# EAGLE board keyBoard_B (EAGLE 6.4)
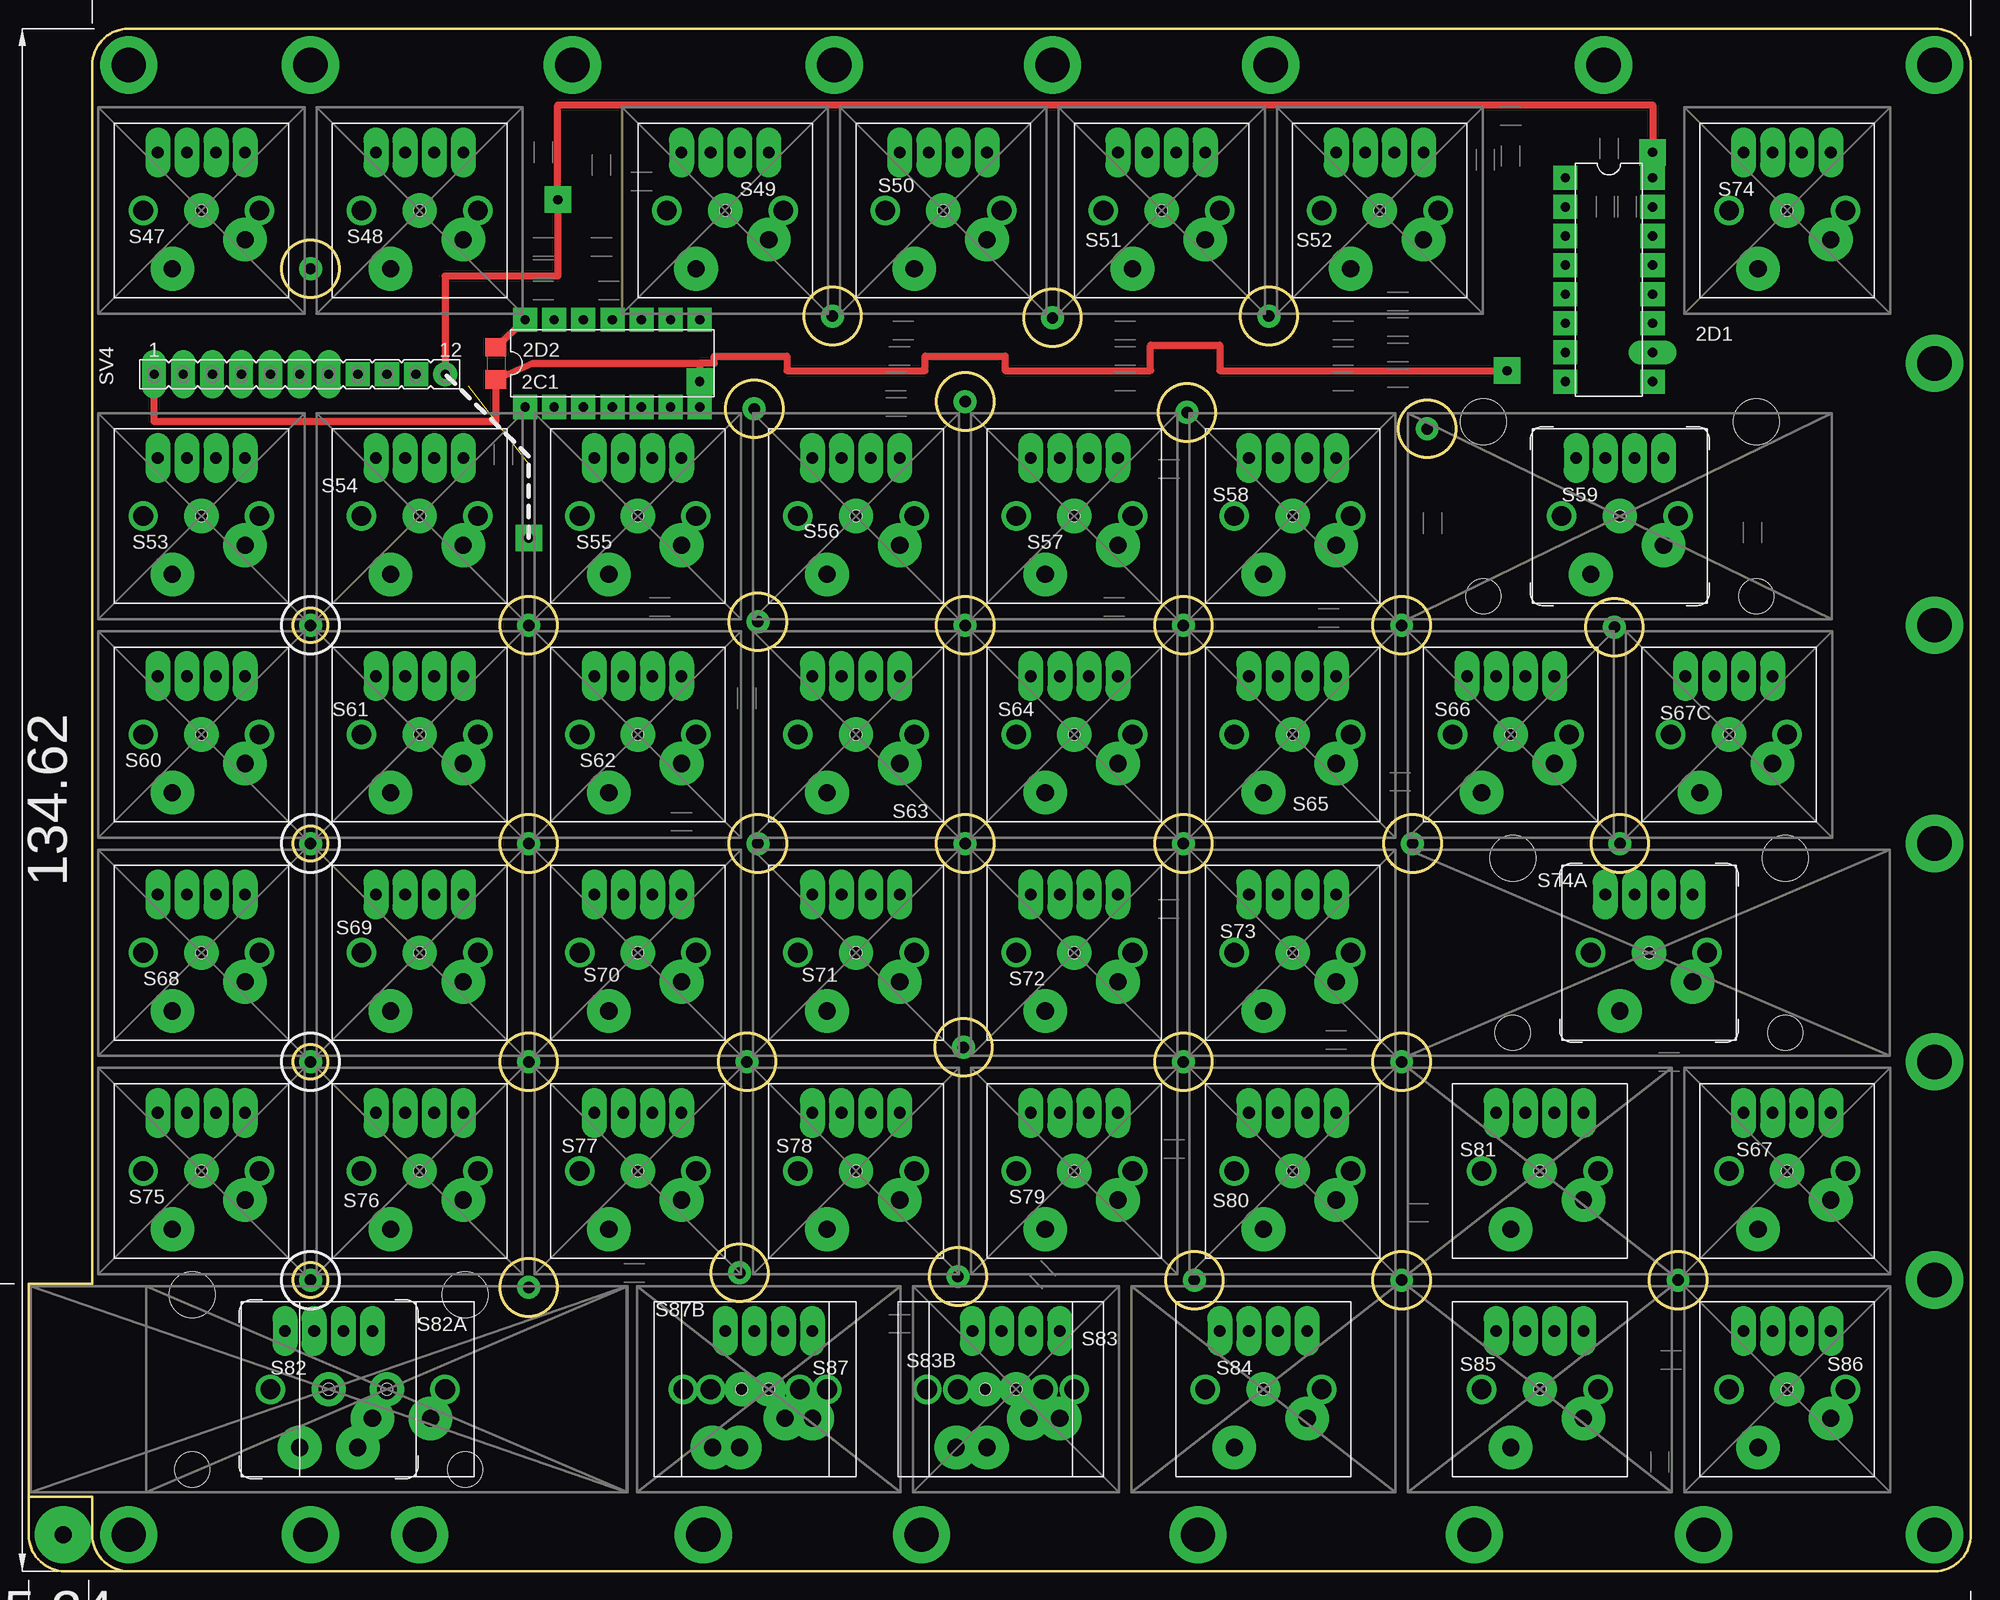
[diagram p1: board, top side]
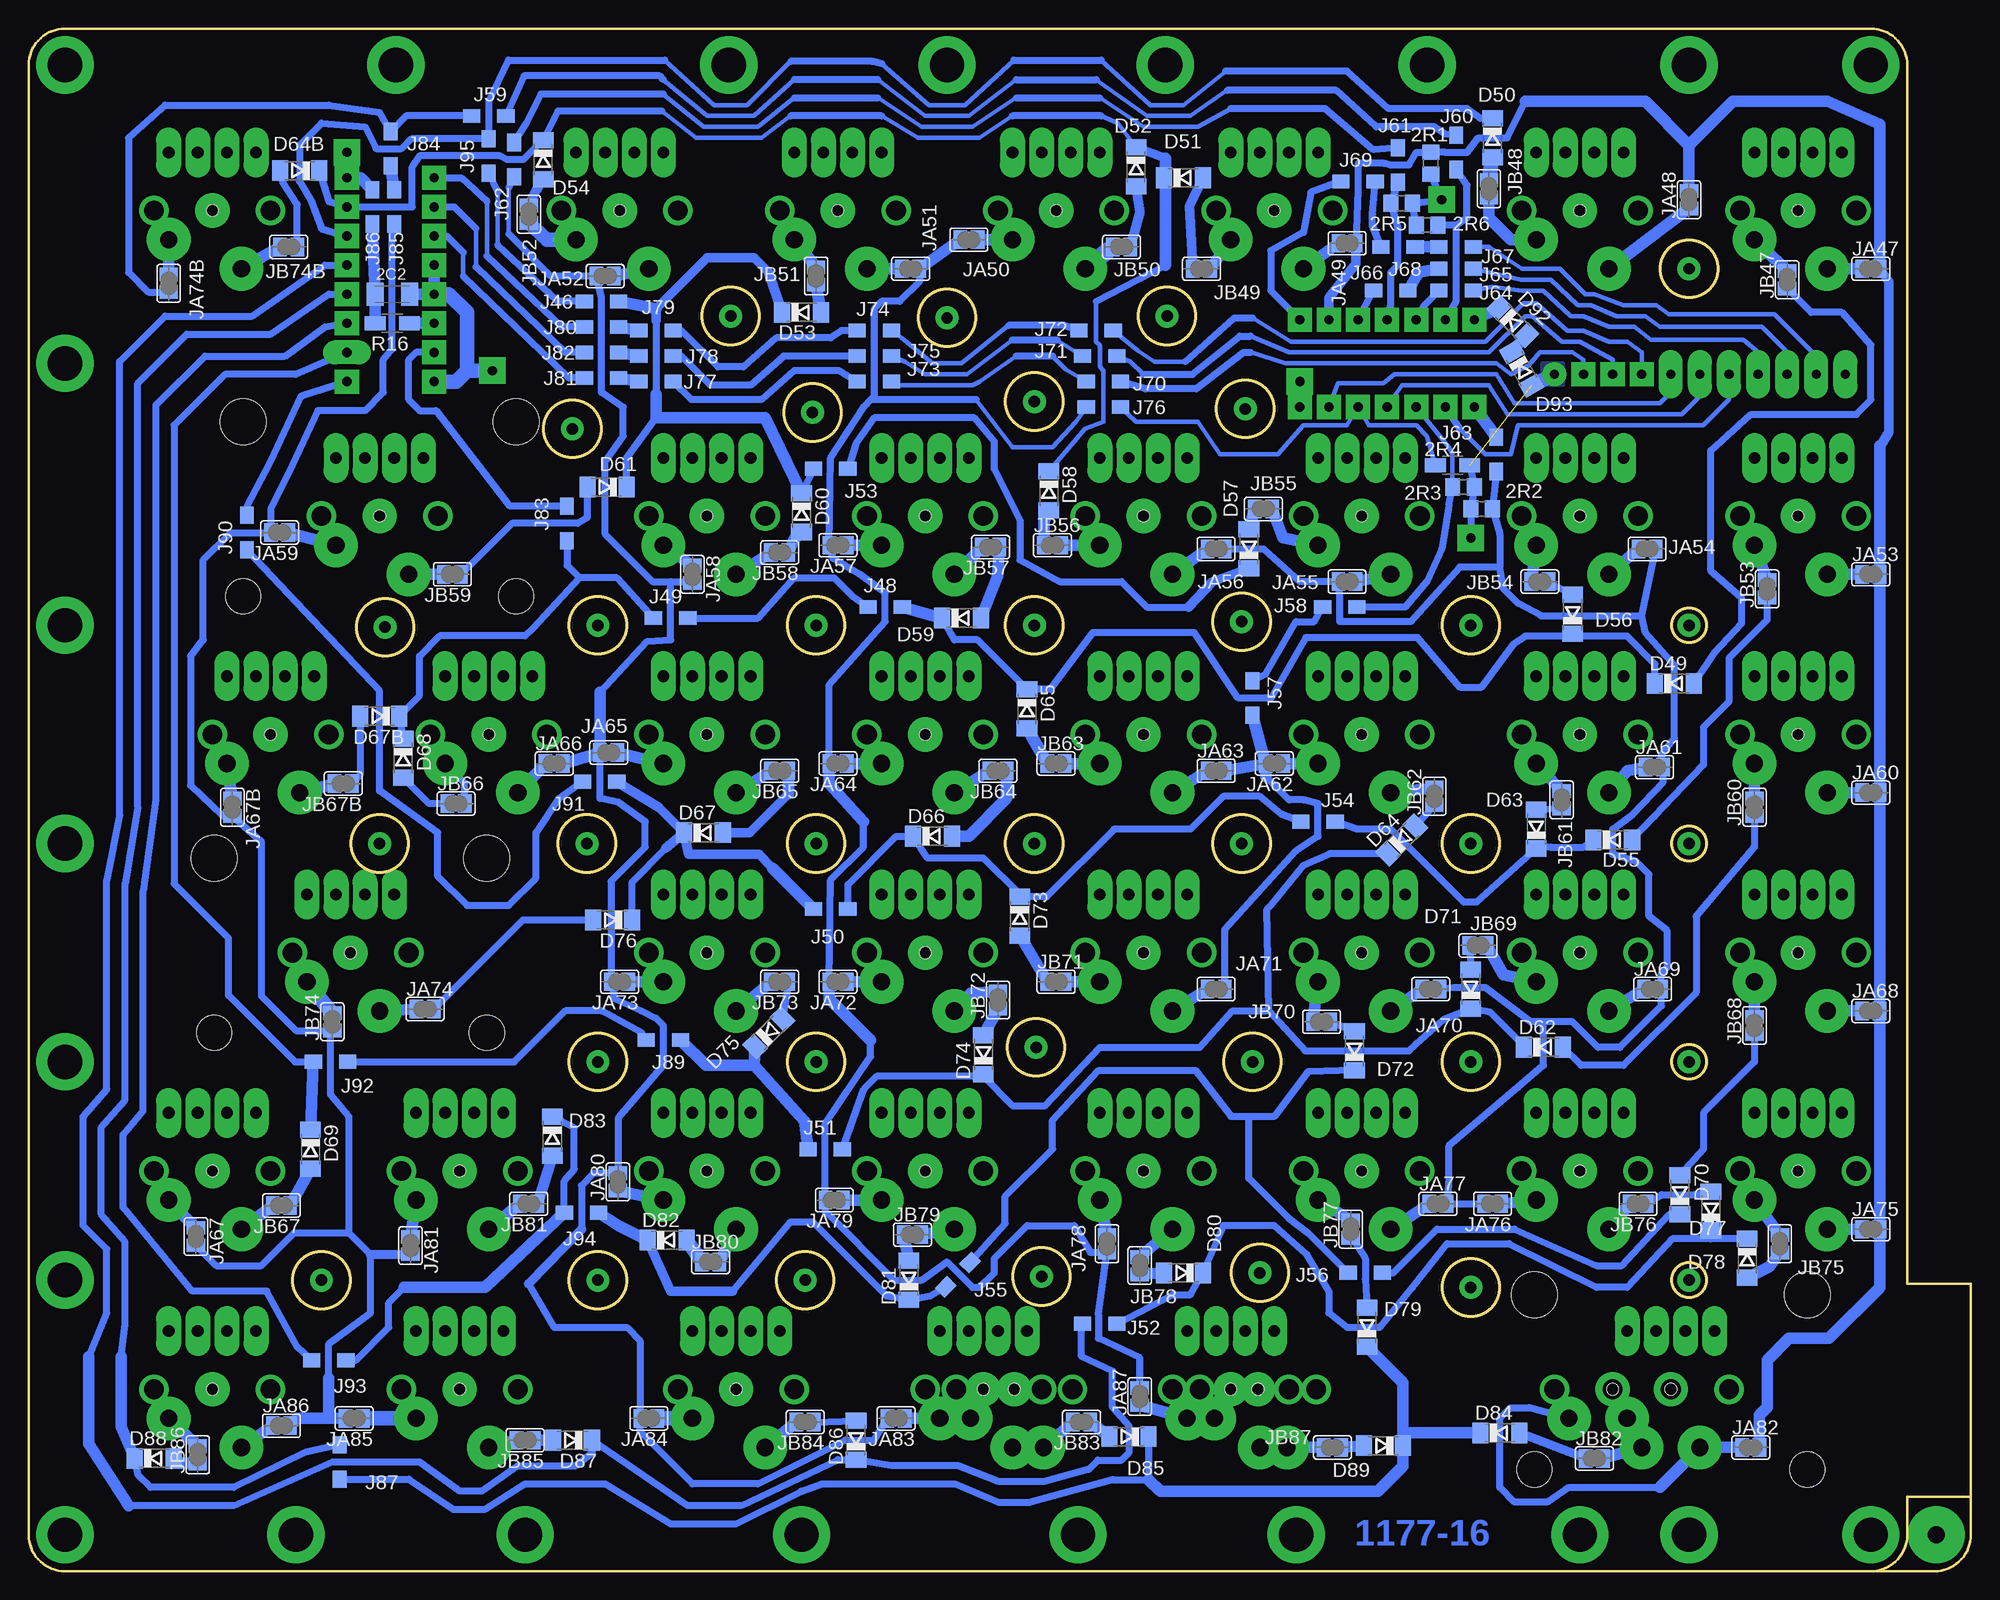
[diagram p2: board, bottom side, seen from below]

Size 169.54 x 134.62 mm. Coordinates in mm from the lower left corner, seen from the top.
Outline: 8.73,0 166.37,0 arc90 169.54,3.18 169.54,131.44 arc90 166.37,134.62 8.73,134.62 arc90 5.56,131.44 5.56,25.08 0,25.08 0,6.51
Outline: 8.73,0 3.02,0
Outline: 0,6.51 5.56,6.51 5.56,3.18 arc90 8.73,0
Outline: 0,6.51 0,3.18 arc90 3.18,0
Outline: circle at 43.66,82.55 radius 2.5
Outline: circle at 63.66,82.87 radius 2.5
Outline: circle at 43.66,63.5 radius 2.5
Outline: circle at 63.66,63.5 radius 2.5
Outline: circle at 81.76,63.5 radius 2.5
Outline: circle at 81.76,82.55 radius 2.5
Outline: circle at 100.81,82.55 radius 2.5
Outline: circle at 100.81,63.5 radius 2.5
Outline: circle at 119.86,82.55 radius 2.5
Outline: circle at 120.81,63.5 radius 2.5
Outline: circle at 138.43,82.39 radius 2.5
Outline: circle at 138.91,63.5 radius 2.5
Outline: circle at 70.17,109.54 radius 2.5
Outline: circle at 89.38,109.38 radius 2.5
Outline: circle at 108.27,109.54 radius 2.5
Outline: circle at 119.86,44.45 radius 2.5
Outline: circle at 43.66,44.45 radius 2.5
Outline: circle at 62.71,44.45 radius 2.5
Outline: circle at 81.6,45.72 radius 2.5
Outline: circle at 100.81,44.45 radius 2.5
Copper layers (1*16): Top 0.035mm / dielectric 1.5mm / Bottom 0.035mm
Design rules "default": minimum track width 10mil, minimum drill 24mil, track to track 8mil, track to pad 8mil, pad to pad 8mil, via to via 8mil, smd to smd 8mil, copper to edge 40mil, drill to drill 8mil, minimum pad ring 10mil, minimum via ring 8mil, stop-mask expansion 4mil, vias tented up to drill 0mil, thermal gap 10mil
Net classes: 1 power: width 0.254 mm, drill 0.61 mm, clearance 0.254 mm; 2 gnd: width 0.254 mm, drill 0.61 mm, clearance 0.254 mm; 3 usbvcc: width 0.254 mm, drill 0.61 mm, clearance 0.254 mm; 4 aref: width 0.254 mm, drill 0.61 mm, clearance 0.254 mm

## Footprints (pad centres in the part's own frame; a part is rotated, then mirrored left to right if it is on the bottom)
C1206 = smd 1.6 x 1.8: 1 -1.4,0; 2 1.4,0
C1206K = smd 1.5 x 2: 1 -1.5,0; 2 1.5,0
DIL16 = drill 0.813 pad 2.1 square: 1 -8.89,-3.81; 2 -6.35,-3.81; 3 -3.81,-3.81; 4 -1.27,-3.81; 5 1.27,-3.81; 6 3.81,-3.81; 7 6.35,-3.81; 8 8.89,-3.81; 9 8.89,3.81; 11 3.81,3.81; 12 1.27,3.81; 13 -1.27,3.81; 14 -3.81,3.81; 15 -6.35,3.81; 16 -8.89,3.81 | drill 0.813 pad 2.1 long: 10 6.35,3.81
DIL14 = drill 0.813 pad 2.1 square: 1 -7.62,-3.81; 2 -5.08,-3.81; 3 -2.54,-3.81; 4 0,-3.81; 5 2.54,-3.81; 6 5.08,-3.81; 7 7.62,-3.81; 8 7.62,3.81; 9 5.08,3.81; 10 2.54,3.81; 11 0,3.81; 12 -2.54,3.81; 13 -5.08,3.81; 14 -7.62,3.81
R0805 = smd 1.3 x 1.5: 1 -0.95,0; 2 0.95,0
R1206W = smd 1.8 x 1.2: 1 -1.499,0; 2 1.499,0
SOD80C = smd 1.4 x 1.8 bottom: A -1.7,0; C 1.7,0
R1206W' = smd 1.5 x 1.2 bottom: 1 1.499,0; 2 -1.499,0
SJ = smd 1.168 x 1.6 bottom: 1 0.762,0; 2 -0.762,0
CHERRY-MX-4P = drill 1.016 pad 2.184 long: D1 -3.81,-5.08; D2 3.81,-5.08; LED1 -1.27,-5.08; LED2 1.27,-5.08 | drill 1 pad 3: P$1 0,0 | drill 1.714 pad 1.93: P$3 -5.08,0; P$4 5.08,0 | drill 1.5 pad 3.81: SW1 -3.81,2.54; SW2 2.54,5.08 | hole 1: 0,0
CHERRY-MX = drill 1 pad 3: P$1 0,0 | drill 1.714 pad 1.93: P$3 -5.08,0; P$4 5.08,0 | drill 1.5 pad 3.81: SW1 -3.81,2.54; SW2 2.54,5.08 | hole 1: 0,0
ZEALIOS-PCB_2U = drill 0.9 pad 3: P$1 -11.906,6.985; P$2 11.906,6.985 | drill 0.9 pad 4: P$3 11.906,-8.255; P$4 -11.906,-8.255 | hole 3.05: -11.9,7; 11.9,7 | hole 4: 11.9,-8.24; -11.9,-8.24
FE12 = drill 0.813 pad 2.1 long: 1 -13.97,0; 2 -11.43,0; 3 -8.89,0; 4 -6.35,0; 5 -3.81,0; 6 -1.27,0; 7 1.27,0 | drill 0.813 pad 2.1 square: 8 3.81,0; 9 6.35,0; 10 8.89,0 | drill 0.813 pad 2.1: 11 11.43,0

## Placement (x,y rotation side)
2C1  100n  [C1206]  40.8,105.41 270 top
2C2  100n  [C1206K]  137.79,111.44 0 bottom
2D1  74HC138N  [DIL16]  137.95,112.71 270 top
2D2  74HC04N  [DIL14]  50.96,105.41 0 top
2R1  10k  [R0805]  47.15,122.87 90 bottom
2R2  10k  [R0805]  42.7,92.71 0 bottom
2R3  10k  [R0805]  44.29,94.61 180 bottom
2R4  10k  [R1206W]  45.24,96.52 180 bottom
2R5  10k  [R0805]  49.69,119.38 180 bottom
2R6  10k  [R0805]  47.47,117.47 0 bottom
D49  LL4148  [SOD80C]  25.88,77.47 0 top
D50  LL4148  [SOD80C]  41.75,125.09 90 top
D51  LL4148  [SOD80C]  68.74,121.6 0 top
D52  LL4148  [SOD80C]  72.87,122.56 90 top
D53  LL4148  [SOD80C]  102.08,109.86 0 top
D54  LL4148  [SOD80C]  124.62,123.19 90 top
D55  LL4148  [SOD80C]  31.27,63.82 0 top
D56  LL4148  [SOD80C]  34.77,83.5 270 top
D57  LL4148  [SOD80C]  63.02,89.22 270 top
D58  LL4148  [SOD80C]  80.49,94.3 90 top
D59  LL4148  [SOD80C]  88.11,83.19 0 top
D60  LL4148  [SOD80C]  102.08,92.39 90 top
D61  LL4148  [SOD80C]  119.06,94.61 180 top
D62  LL4148  [SOD80C]  37.31,45.72 0 top
D63  LL4148  [SOD80C]  37.94,64.77 270 top
D64  LL4148  [SOD80C]  49.69,63.82 315 top
D64B  LL4148  [SOD80C]  145.89,122.24 180 top
D65  LL4148  [SOD80C]  82.39,75.25 90 top
D66  LL4148  [SOD80C]  90.65,64.14 0 top
D67  LL4148  [SOD80C]  110.65,64.45 0 top
D67B  LL4148  [SOD80C]  138.91,74.61 180 top
D68  LL4148  [SOD80C]  136.84,70.96 90 top
D69  LL4148  [SOD80C]  144.94,36.83 90 top
D70  LL4148  [SOD80C]  25.4,32.86 270 top
D71  LL4148  [SOD80C]  43.66,50.8 270 top
D72  LL4148  [SOD80C]  53.82,45.4 270 top
D73  LL4148  [SOD80C]  83.03,57.15 90 top
D74  LL4148  [SOD80C]  86.2,45.09 270 top
D75  LL4148  [SOD80C]  104.93,46.99 315 top
D76  LL4148  [SOD80C]  118.59,56.83 180 top
D77  LL4148  [SOD80C]  19.53,27.3 90 top
D78  LL4148  [SOD80C]  22.7,31.43 270 top
D79  LL4148  [SOD80C]  52.71,21.27 270 top
D80  LL4148  [SOD80C]  68.74,26.03 180 top
D81  LL4148  [SOD80C]  92.71,25.4 270 top
D82  LL4148  [SOD80C]  113.82,28.89 0 top
D83  LL4148  [SOD80C]  123.82,37.94 90 top
D84  LL4148  [SOD80C]  41.12,12.07 0 top
D85  LL4148  [SOD80C]  73.5,11.75 180 top
D86  LL4148  [SOD80C]  97.31,11.43 270 top
D87  LL4148  [SOD80C]  122.08,11.43 180 top
D88  LL4148  [SOD80C]  158.59,9.84 0 top
D89  LL4148  [SOD80C]  51.28,10.95 180 top
D92  LL4148  [SOD80C]  40.01,109.06 45 top
D93  LL4148  [SOD80C]  39.21,104.93 60 top
J46  [R1206W']  119.54,110.81 0 top
J48  [R1206W']  94.77,84.14 0 top
J49  [R1206W']  113.51,83.19 0 top
J50  [R1206W']  99.54,57.78 0 top
J51  [R1206W']  100.01,36.83 0 top
J52  [R1206W']  76.04,21.59 0 top
J53  [R1206W']  99.54,96.2 180 top
J54  [R1206W']  56.99,65.41 180 top
J55  [R1206W']  88.42,25.88 135 top
J56  [R1206W']  52.86,26.03 180 top
J57  [R1206W']  62.71,76.2 90 top
J58  [R1206W']  55.09,84.14 180 top
J59  [R1206W']  129.38,127 180 top
J60  [R1206W']  44.93,123.82 270 top
J61  [R1206W']  50.01,122.71 270 top
J62  [R1206W']  127.16,123.19 90 top
J63  [R1206W']  41.43,97.47 90 top
J64  [R1206W']  44.93,111.76 180 top
J65  [R1206W']  44.93,113.66 180 top
J66  [R1206W']  50.64,111.76 180 top
J67  [R1206W']  44.93,115.57 180 top
J68  [R1206W']  50.01,115.57 180 top
J69  [R1206W']  53.5,121.28 180 top
J70  [R1206W']  75.72,103.82 0 top
J71  [R1206W']  76.04,106.05 0 top
J72  [R1206W']  76.36,108.27 0 top
J73  [R1206W']  95.73,103.82 0 top
J74  [R1206W']  95.73,106.05 0 top
J75  [R1206W']  95.73,108.27 0 top
J76  [R1206W']  75.72,101.6 180 top
J77  [R1206W']  114.78,103.82 0 top
J78  [R1206W']  114.78,106.05 0 top
J79  [R1206W']  114.78,108.27 0 top
J80  [R1206W']  119.54,108.58 0 top
J81  [R1206W']  119.54,104.14 0 top
J82  [R1206W']  119.54,106.36 0 top
J83  [R1206W']  122.56,91.44 270 top
J84  [R1206W']  137.95,124.14 270 top
J85  [R1206W']  137.64,119.06 270 top
J86  [R1206W']  139.54,119.06 270 top
J87  [R1206W']  142.4,9.52 270 top
J89  [R1206W']  114.14,46.35 180 top
J90  [R1206W']  150.5,90.65 270 top
J91  [R1206W']  119.7,68.9 180 top
J92  [R1206W']  143.19,44.45 180 top
J93  [R1206W']  143.35,18.41 180 top
J94  [R1206W']  121.28,31.27 180 top
J95  [R1206W']  129.38,123.51 90 top
JA47  [SJ]  8.73,113.66 0 top
JA48  [SJ]  24.61,119.7 270 top
JA49  [SJ]  54.45,115.89 0 top
JA50  [SJ]  87.47,116.21 180 top
JA51  [SJ]  92.55,113.66 0 top
JA52  [SJ]  119.22,113.03 180 top
JA53  [SJ]  8.73,87 0 top
JA54  [SJ]  28.26,89.22 0 top
JA55  [SJ]  54.45,86.36 180 top
JA56  [SJ]  65.88,89.22 0 top
JA57  [SJ]  98.9,89.53 180 top
JA58  [SJ]  111.6,87 90 top
JA59  [SJ]  147.64,90.65 180 top
JA60  [SJ]  8.73,67.94 0 top
JA61  [SJ]  27.62,70.17 0 top
JA62  [SJ]  60.8,70.48 180 top
JA63  [SJ]  65.88,69.85 0 top
JA64  [SJ]  98.9,70.48 180 top
JA65  [SJ]  118.9,71.44 180 top
JA66  [SJ]  123.67,70.48 0 top
JA67  [SJ]  154.94,29.21 90 top
JA67B  [SJ]  151.76,66.67 90 top
JA68  [SJ]  8.73,48.89 0 top
JA69  [SJ]  27.78,50.8 0 top
JA70  [SJ]  47.15,50.8 0 top
JA71  [SJ]  65.88,50.8 0 top
JA72  [SJ]  98.9,51.44 180 top
JA73  [SJ]  117.95,51.44 180 top
JA74  [SJ]  134.94,49.05 0 top
JA74B  [SJ]  157.32,112.4 90 top
JA75  [SJ]  8.73,29.84 0 top
JA76  [SJ]  41.75,32.07 180 top
JA77  [SJ]  46.51,32.07 0 top
JA78  [SJ]  75.41,28.58 90 top
JA79  [SJ]  99.22,32.38 180 top
JA80  [SJ]  118.11,33.97 270 top
JA81  [SJ]  136.21,28.42 90 top
JA82  [SJ]  19.21,10.8 0 top
JA83  [SJ]  93.82,13.34 180 top
JA84  [SJ]  115.41,13.34 180 top
JA85  [SJ]  141.13,13.34 180 top
JA86  [SJ]  147.48,12.7 0 top
JA87  [SJ]  72.55,15.24 270 top
JB47  [SJ]  16.03,112.71 270 top
JB48  [SJ]  42.07,120.65 90 top
JB49  [SJ]  67.15,113.66 0 top
JB50  [SJ]  74.14,115.57 180 top
JB51  [SJ]  100.81,113.03 270 top
JB52  [SJ]  125.89,118.43 90 top
JB53  [SJ]  17.78,85.72 270 top
JB54  [SJ]  37.62,86.36 180 top
JB55  [SJ]  61.75,92.71 0 top
JB56  [SJ]  80.17,89.53 0 top
JB57  [SJ]  85.57,89.38 180 top
JB58  [SJ]  103.98,88.9 180 top
JB59  [SJ]  132.56,87 180 top
JB60  [SJ]  18.89,66.67 270 top
JB61  [SJ]  35.72,67.31 270 top
JB62  [SJ]  46.83,67.63 270 top
JB63  [SJ]  79.85,70.48 0 top
JB64  [SJ]  84.93,69.85 180 top
JB65  [SJ]  103.98,69.85 180 top
JB66  [SJ]  132.24,66.99 0 top
JB67  [SJ]  147.48,31.91 180 top
JB67B  [SJ]  142.08,68.74 180 top
JB68  [SJ]  18.89,47.62 270 top
JB69  [SJ]  43.02,54.61 0 top
JB70  [SJ]  56.67,47.94 180 top
JB71  [SJ]  79.85,51.44 0 top
JB72  [SJ]  84.93,49.85 270 top
JB73  [SJ]  103.98,51.44 180 top
JB74  [SJ]  143.03,47.94 270 top
JB74B  [SJ]  146.84,115.57 180 top
JB75  [SJ]  16.67,28.58 270 top
JB76  [SJ]  29.05,32.07 180 top
JB77  [SJ]  54.13,29.84 270 top
JB78  [SJ]  72.55,26.67 270 top
JB79  [SJ]  92.39,29.37 0 top
JB80  [SJ]  110.01,26.99 0 top
JB81  [SJ]  125.89,32.07 180 top
JB82  [SJ]  32.86,9.84 0 top
JB83  [SJ]  77.63,13.02 180 top
JB84  [SJ]  101.76,13.02 180 top
JB85  [SJ]  126.21,11.43 180 top
JB86  [SJ]  154.78,10.16 270 top
JB87  [SJ]  55.72,10.8 180 top
R16  1k  [R1206W]  137.79,108.9 0 bottom
S47  F7  [CHERRY-MX-4P]  15.08,118.75 180 top
S48  F8  [CHERRY-MX-4P]  34.13,118.75 180 top
S49  F9  [CHERRY-MX-4P]  60.8,118.75 180 top
S50  F10  [CHERRY-MX-4P]  79.85,118.75 180 top
S51  F11  [CHERRY-MX-4P]  98.9,118.75 180 top
S52  F12  [CHERRY-MX-4P]  117.95,118.75 180 top
S53  7  [CHERRY-MX-4P]  15.08,92.08 180 top
S54  8  [CHERRY-MX-4P]  34.13,92.08 180 top
S55  9  [CHERRY-MX-4P]  53.18,92.08 180 top
S56  0  [CHERRY-MX-4P]  72.23,92.08 180 top
S57  -  [CHERRY-MX-4P]  91.28,92.08 180 top
S58  =  [CHERRY-MX-4P]  110.33,92.08 180 top
S59  BS  [CHERRY-MX-4P]  138.91,92.08 180 top
S60  Y  [CHERRY-MX-4P]  15.08,73.03 180 top
S61  U  [CHERRY-MX-4P]  34.13,73.03 180 top
S62  I  [CHERRY-MX-4P]  53.18,73.03 180 top
S63  O  [CHERRY-MX-4P]  72.23,73.03 180 top
S64  P  [CHERRY-MX-4P]  91.28,73.03 180 top
S65  [  [CHERRY-MX-4P]  110.33,73.03 180 top
S66  ]  [CHERRY-MX-4P]  129.38,73.03 180 top
S67  |d  [CHERRY-MX-4P]  153.51,34.92 180 top
S67C  |u  [CHERRY-MX-4P]  148.43,73.03 180 top
S68  H  [CHERRY-MX-4P]  15.08,53.97 180 top
S69  J  [CHERRY-MX-4P]  34.13,53.97 180 top
S70  K  [CHERRY-MX-4P]  53.18,53.97 180 top
S71  L  [CHERRY-MX-4P]  72.23,53.97 180 top
S72  :  [CHERRY-MX-4P]  91.28,53.97 180 top
S73  "  [CHERRY-MX-4P]  110.33,53.97 180 top
S74  Del  [CHERRY-MX-4P]  153.51,118.75 180 top
S74A  Enter  [CHERRY-MX-4P]  141.45,53.97 180 top
S75  N  [CHERRY-MX-4P]  15.08,34.92 180 top
S76  M  [CHERRY-MX-4P]  34.13,34.92 180 top
S77  <  [CHERRY-MX-4P]  53.18,34.92 180 top
S78  >  [CHERRY-MX-4P]  72.23,34.92 180 top
S79  ~  [CHERRY-MX-4P]  91.28,34.92 180 top
S80  ?  [CHERRY-MX-4P]  110.33,34.92 180 top
S81  R Shift  [CHERRY-MX-4P]  131.92,34.92 180 top
S82  Space  [CHERRY-MX-4P]  26.19,15.88 180 top
S82A  space  [CHERRY-MX]  31.27,15.88 180 top
S83  FN3  [CHERRY-MX-4P]  86.2,15.88 180 top
S83B  [CHERRY-MX]  83.5,15.88 180 top
S84  R_Alt  [CHERRY-MX-4P]  107.79,15.88 180 top
S85  RCtrl  [CHERRY-MX-4P]  131.92,15.88 180 top
S86  PrtScr  [CHERRY-MX-4P]  153.51,15.88 180 top
S87  FN2  [CHERRY-MX-4P]  64.61,15.88 180 top
S87B  [CHERRY-MX]  62.23,15.88 180 top
STAB_BS  STAB  [ZEALIOS-PCB_2U]  138.91,92.08 180 top
STAB_EN  STAB  [ZEALIOS-PCB_2U]  141.45,53.97 180 top
STAB_RSP  STAB  [ZEALIOS-PCB_2U]  26.19,15.88 180 top
SV4  CON_KB_B  [FE12]  24.92,104.46 0 top
U$1  [18X23]  63.34,17.15 0 top
U$2  [18X18]  147.16,74.3 0 top
U$4  [18X23]  130.65,36.2 0 top
U$5  [18X37]  138.91,92.08 0 top
U$53  [18X18]  13.81,120.01 0 top
U$54  [18X18]  32.86,120.01 0 top
U$55  [18X18]  97.63,120.01 0 top
U$56  [18X18]  59.53,120.01 0 top
U$57  [18X18]  78.58,120.01 0 top
U$58  [18X18]  116.68,120.01 0 top
U$59  [18X18]  13.81,93.34 0 top
U$60  [18X18]  32.86,93.34 0 top
U$61  [18X18]  51.91,93.34 0 top
U$62  [18X18]  70.96,93.34 0 top
U$63  [18X18]  90.01,93.34 0 top
U$64  [18X18]  109.06,93.34 0 top
U$65  [18X18]  13.81,74.3 0 top
U$66  [18X18]  32.86,74.3 0 top
U$67  [18X18]  51.91,74.3 0 top
U$68  [18X18]  70.96,74.3 0 top
U$69  [18X18]  90.01,74.3 0 top
U$70  [18X18]  109.06,74.3 0 top
U$71  [18X18]  128.11,74.3 0 top
U$72  [18X18]  152.24,36.2 0 top
U$73  [18X18]  13.81,55.25 0 top
U$74  [18X18]  32.86,55.25 0 top
U$75  [18X18]  51.91,55.25 0 top
U$76  [18X18]  70.96,55.25 0 top
U$77  [18X18]  90.01,55.25 0 top
U$78  [18X18]  109.06,55.25 0 top
U$79  [18X18]  13.81,36.2 0 top
U$80  [18X18]  32.86,36.2 0 top
U$81  [18X18]  152.24,120.01 0 top
U$83  [18X18]  51.91,36.2 0 top
U$84  [18X18]  70.96,36.2 0 top
U$85  [18X18]  90.01,36.2 0 top
U$86  [18X18]  109.06,36.2 0 top
U$87  [18X52]  26.19,15.88 0 top
U$89  [18X18]  152.24,17.15 0 top
U$90  [18X23]  130.65,17.15 0 top
U$92  [18X23]  106.52,17.15 0 top
U$94  [18X42]  141.45,53.97 0 top
U$95  [18X18]  84.93,17.15 0 top
U$105  [18X42]  31.27,15.88 180 top

## Tracks (layer width: path | path; a pad name or v marks a point on that pad's centre or on a via)
2I
  Bottom 0.406: 83.55,131.88 87.79,127.95 90.96,127.95 95.09,131.56 | 75.93,131.88 71.6,127.95 68.74,127.95 65.04,130.92 | 103.03,131.76 106.84,127.95 109.7,127.95 114.03,131.88
  Bottom 0.61: D50.C 42.82,126.79 43.97,127.63 50.85,127.63 54.45,130.92 65.04,130.92 | 83.55,131.88 75.93,131.88 | 114.03,131.88 127.68,131.88 129.38,128.27 J95.1 136.14,125.01 137,124.14 139.22,124.14 140.18,126.05 143.99,126.37 145.89,124.46 145.89,121.28 144.94,119.7 143.99,117.16 2D1.14 | 95.09,131.56 95.93,131.76 103.03,131.76
8J
  Bottom 0.61: J87.1 136.37,8.03 132.47,5.4 129.7,5.4 126.21,7.62 119.22,7.62 113.51,4.13 107.79,4.13 102.08,6.98 100.28,7.62 88.74,7.62 84.93,6.03 82.07,6.03 74.89,7.98 71.8,7.98 D85.C
  Bottom 1.016: 71.8,7.98 70.76,6.98 51.75,6.98 49.58,9.16 D89.C 49.58,12.07 | 49.58,12.07 D84.C | 49.58,12.07 49.58,16.44 D79.C
+3VD
  Top 0.61: 2C1.1 2D2.14
  Bottom 1.016: D92.C 2D2.14
+5V/2  (via drill 0.8 pad 2.3)  (1 unrouted)
  Top 0.61: SV4.11 36.35,113.03 46.2,113.03 v46.2,119.7 46.2,127.95 141.76,127.95 v141.76,123.82
  Bottom 0.61: 2R4.1 2R3.1 2R2.1 v43.66,90.17 | 2R1.1 v46.2,119.7 2R5.1 2R6.1
  Bottom 1.016: v141.76,123.82 2D1.16 140.58,121.6 J86.2
  Bottom 1.27: SV4.11 D93.A
  pour Bottom (no thermals): 35.56,103.5 35.56,105.41 37.47,105.41 37.47,104.78 36.83,103.5
B1
  Bottom 0.406: D58.C 77.31,99.69 75.72,100.33 75.72,104.78 76.04,105.09 76.04,107 76.36,107.31 76.36,110.81 | 83.66,127 86.52,125.09 91.92,125.09 95.09,127 | 75.93,127 74.45,126.37 D52.C | 103.03,127 105.57,125.09 111.28,125.09 114.25,127.43
  Bottom 0.61: 114.25,127.43 123.35,127.43 D54.C 125.73,123.82 126.36,123.19 127.79,123.19 128.43,123.51 135.41,123.51 136.05,122.56 136.05,119.06 2D1.15 143.35,119.54 D64B.C | 76.36,110.81 70.33,113.98 | 75.93,127 83.66,127 | 95.09,127 103.03,127
  Bottom 0.813: D52.C 70.33,123.3 D51.C
  Bottom 1.016: 70.33,113.98 70.33,123.3
B2
  Bottom 0.61: J53.2 D60.C | D61.C 117.36,97.11 114.78,100.65 | 114.78,109.11 114.78,102.71
  Bottom 0.813: 114.78,109.11 114.78,110.17 110.33,114.62 106.2,114.62 104.93,113.35 D53.C
  Bottom 1.016: D60.C 105.25,100.65 114.78,100.65 114.78,102.71 | J46.2 114.78,110.17
B2J
  Bottom 0.61: 68.31,84.14 71.91,84.14 74.14,86.36 79.53,86.36 83.03,88.27 83.03,91.76 85.25,96.2 85.25,98.58 87,100.65 95.73,100.65 97.31,98.42 J53.1
  Bottom 0.813: 68.31,84.14 66.2,86.36 D57.C
B3
  Bottom 0.61: D59.C 88.74,81.28 86.72,81.28 D65.C 80.37,76.95 76.68,81.92 67.79,81.92 63.98,76.2 61.12,76.2 58.06,81.48 48.31,81.48 44.61,77.15 42.7,77.15 39.85,80.96 38.89,81.6 34.77,81.6 | D49.C 27.58,79.17 30,81.6 34.77,81.6 | D56.C 34.77,81.6
  Bottom 1.016: D59.C J48.2
B3J
  Bottom 0.61: 121.44,86.68 118.18,86.68 J49.1 | 121.44,86.68 125.57,82.23 126.23,81.62 133.65,81.62 135.41,79.85 135.41,76.41 D67B.C D68.C 136.37,72.59 | J83.1 122.56,87.79 121.44,86.68
B4
  Bottom 0.61: D76.C 116.89,60.12 113.94,63.07
  Bottom 0.813: 104.62,61.37 105.8,62.55 111.92,62.55 D67.C | J91.1 114.57,66.67 D67.C | 113.94,63.07 D67.C
  Bottom 1.016: J50.1 104.62,61.37
B4J
  Bottom 0.61: J50.2 98.04,59.92 93.82,64.14 D66.C 91.08,62.23 86.2,62.23 83.03,59.06 D73.C 80.69,58.85 74.77,64.77 68.1,64.77 65.25,67.63 62.07,67.63 60.17,66.04 J54.2
B4J2
  Bottom 0.61: J54.1 53.59,64.77 50.64,64.77 44.29,58.42 43.13,58.42 D63.C 37.42,63.3 36.67,63.18 33.81,63.18 D55.C
B5
  Bottom 1.016: J51.1 101.83,39.28 106.2,44.13 | D75.C 106.2,44.13 | 106.2,44.13 110.42,44.13 J89.1
B5J
  Bottom 0.61: J51.2 96.61,42.09 95.52,43.18 86.2,43.18 | 86.2,43.18 83.66,40.64 80.8,40.64 76.04,45.72 67.31,45.72 64.45,48.89 61.28,48.89 | 86.2,43.18 D74.C | D64.C 55.97,62.61 58.26,61.59 61.12,58.1 61.44,57.78 61.28,48.89 | 61.28,48.89 58.1,45.4 49.05,45.4 48.42,46.04 45.99,48.15 D71.C 41.96,48.78 39.21,46.04 D62.C
B5J4
  Bottom 0.61: J92.1 127.16,44.45 122.71,48.89 119.54,48.89 116.05,46.99 J89.2
B5J5
  Bottom 0.61: 2D1.10 146.21,104.46 152.4,104.46 156.84,100.01 156.84,60.01 152.08,55.25 152.08,50.25 146.28,44.45 J92.2
  Bottom 1.016: D69.C J92.2
B6
  Bottom 0.61: J55.2 90.85,24.02 D81.C 94.66,24.02 101.12,30.48 103.03,30.48 108.11,24.45
  Bottom 0.813: 108.11,24.45 113.51,24.45 D82.C
  Bottom 1.016: D82.C 118.06,30.16 J94.1
B6J2
  Bottom 0.61: 63.02,39.69 64.61,39.69 67.68,43.71 76.15,43.71 80.17,39.37 80.17,36.83 84.3,32.7 84.3,30.32 J55.1 | 63.02,39.69 60.8,39.69 57.85,43.59 D72.C | 63.02,39.69 63.02,34.29 59.53,30.8 57.85,29.53 J56.2
B6J3
  Bottom 0.61: D70.C 26.35,31.12 30.48,26.67 32.7,26.67 39.85,29.84 46.6,29.84 50.41,26.03 J56.1
B6J4
  Bottom 0.61: J93.1 140.97,18.41 138.11,21.27 138.11,23.42 136.77,24.77 | J94.2 122.78,34.06 121.92,35.08 121.92,38.69 D83.C
  Bottom 1.016: 136.77,24.77 129.7,24.77 J94.2
B7
  Bottom 0.61: 160.81,5.71 151.61,5.71 143.03,9.52 135.41,9.52 131.92,6.98 130.02,6.98 126.84,9.21 121.76,9.21 120.38,10.27 D87.C 112.03,5.71 107.36,5.71 98.9,9.73 D86.C 94.25,9.21 88.42,9.21 84.82,7.82 80.92,7.82 76.99,8.89 76.2,9.68 74.14,9.68 73.5,10.32 73.5,12.7 74.93,14.29 74.93,17.46 77.63,18.73 77.63,21.5 J52.1 | 164.31,18.73 162.72,22.54 162.72,28.1 164.78,30.16 164.78,39.69 162.72,42.07 162.72,60.33 161.61,66.04 161.61,105.57 157.64,109.54 150.02,109.54 143.67,113.98 2D1.13
  Bottom 1.016: 164.31,18.73 164.31,11.11 160.81,5.71
B7J
  Bottom 0.61: D77.C 22.7,29.01 | 22.7,29.01 26.08,29.01 30,24.77 32.66,24.77 40.32,28.58 45.72,28.58 48.74,24.77 51.59,21.27 54.45,21.27 56.04,22.54 56.04,24.45 57.94,27.62 60.8,30.16 65.25,30.16 D80.C 68.1,24.13 69.69,24.13 J52.2 | D78.C 22.7,29.01
B8
  Bottom 0.61: 161.45,18.73 161.13,21.59 161.13,28.73 163.19,31.12 163.19,38.73 161.13,41.12 161.13,60.01 160.02,66.67 160.02,103.66 155.73,107.95 148.43,107.95 143.35,111.44 2D1.12 | D88.C 159.97,8.37 158.91,7.3 151.61,7.3 145.34,10.39 J87.2
  Bottom 1.016: 161.45,18.73 161.45,12.59 D88.C
BD1
  Bottom 0.406: SV4.8 28.73,106.36 30,107.31 31.59,107.31 33.81,108.27 35.24,108.27 37.94,110.65 39.05,110.65 42.39,107.31 59.37,107.31 62.71,109.38 | 68.58,105.57 71.28,105.57 72.71,106.52 J72.2
  Bottom 0.61: 68.58,105.57 64.29,109.38 62.71,109.38
BD2
  Bottom 0.406: SV4.9 31.27,105.73 34.13,107.31 35.72,107.31 38.26,109.54 38.89,109.54 42.07,106.36 59.53,106.36 62.87,107.79 | 72.23,104.46 73.34,105.57 J71.2
  Bottom 0.61: 72.23,104.46 67.94,104.46 63.82,107.79 62.87,107.79
BD3
  Bottom 0.406: SV4.10 33.81,105.73 34.77,106.36 37.62,106.36 38.58,105.25 40.16,104.46 41.43,105.41 59.85,105.41 62.87,106.36
  Bottom 0.61: J70.2 72.07,103.19 67.63,103.19 63.5,106.36 62.87,106.36
FN2A
  Bottom 1.016: S87.SW2 S87B.SW2 JB87.2
FN2B
  Bottom 1.016: JA87.1 S87.SW1 S87B.SW1
FN3A
  Bottom 1.016: JB83.2 S83B.SW2 S83.SW2
FN3B
  Bottom 1.016: JA83.1 S83.SW1 S83B.SW1
G1
  Bottom 0.61: JA49.2 53.5,120.52 53.5,122.87 51.28,122.87 50.64,122.71 49.05,122.71 48.42,123.82 2R1.2 45.88,123.82 43.97,123.82 43.02,125.09 40.48,125.09 38.89,128.27
  Bottom 0.813: JA49.2 53.69,114.11 56.04,111.12 2D2.9 | JA47.2 7.14,112.52 7.14,99.38 7.97,98.11
  Bottom 1.016: JA47.2 7.97,126.29 12.54,128.27 20.8,128.27 24.61,124.46 | 7.97,98.23 7.97,98.11 JA53.2 JA60.2 JA68.2 JA75.2 7.97,27.94 7.97,27.75 7.97,24.73 12.38,20.32 15.88,20.32 17.78,18.41 17.78,14.29 18.45,13.62 JA82.2 | 24.61,124.46 JA48.2 | 38.89,128.27 28.42,128.27 24.61,124.46
G2
  Bottom 0.61: JA56.2 61.75,89.22 58.58,86.36 JA55.2 55.09,85.09 55.09,82.87 48.9,82.87 44.61,87.63 41.12,87.63 | JA70.2 45.12,50.93 42.39,50.93 38.45,47.94 37.31,47.94 | 28.73,83.38 28.42,81.92 25.88,79.06 25.88,72.71 27.02,71.25 JA61.2 26.86,68.87 29.53,66.04 31.27,64.77 31.27,62.55 29.21,61.91 28.1,60.8 28.1,57.15 26.51,55.88 26.51,52.7 27.02,52.2 JA69.2 27.02,49.34 30.64,45.72 32.54,45.72 34.77,47.94 37.31,47.94 | 28.73,83.38 JA54.2 | 37.31,47.94 37.31,44.13 39.53,42.23 45.56,37.15 45.56,34.29 JA77.2 JA76.2 | 41.12,87.63 40.8,85.72 39.53,84.45 37.5,83.38 28.73,83.38 | J63.2 2R2.2 41.12,90.49 41.12,87.63
G3
  Bottom 0.61: JA71.2 65.12,56.01 58.9,62.86 56.99,64.14 56.99,66.99 58.26,67.31 59.52,67.31 61.53,69.33
  Bottom 1.016: J57.2 JA62.2 | JA62.2 JA63.2 | 61.53,69.33 JA62.2
G4
  Bottom 0.406: J76.2 78.1,100.33 80.17,98.11 83.66,98.11 86.84,102.23
  Bottom 0.61: JA64.2 99.66,77.34 94.77,82.87 94.77,85.41 97,87 99.35,88.39 JA57.2 99.54,97.16 96.68,101.6 96.04,102.23 | JA72.2 99.54,60.33 96.68,63.18 96.68,65.41 | 96.04,46.35 96.04,44.93 100.01,39.05 100.01,32.58 JA79.2 99.98,31.4 93.98,25.4 91.6,25.4 89.38,26.99 87.15,24.77 86.52,24.77 85.25,26.03 85.25,27.3 82.39,30.16 78.26,30.16 76.87,27.81 JA78.2 76.17,22.42 76.17,20.32 72.55,18.6 JA87.2 | 86.84,102.23 96.04,102.23 | JA51.2 91.79,112.52 93.5,110.81 95.09,110.81 95.73,110.17 95.73,102.55 96.04,102.23
  Bottom 1.016: JA51.2 JA50.2 | JA64.2 99.66,68.71 96.68,65.41 | JA72.2 99.66,49.97 96.04,46.35
G5
  Bottom 0.406: 127.63,120.74 127.63,116.7
  Bottom 0.61: 113.51,86.36 115.09,86.36 119.22,90.49 119.22,96.84 117.63,99.06 117.63,101.6 119.54,102.87 119.54,111.12 JA52.2 123.96,113.03 127.63,116.7 | 113.51,86.36 111.73,86.36 JA58.2 | 119.67,76.71 115.54,81.15 113.51,81.28 113.51,86.36 | JA65.2 119.67,67.44 118.08,67.12 115.73,65.41 115.73,63.18 118.71,60.2 JA73.2 118.4,49.97 116.05,48.89 114.78,48.26 114.14,47.62 114.14,44.13 118.08,39.56 118.08,33.97 JA80.2 120.21,34.73 121.28,33.66 121.28,29.84 | JA83.2 95.73,11.43 98.27,11.43 105.89,7.62 111.6,7.62 116.17,12.19 JA84.2 116.17,20.13 117.32,21.27 123.67,21.27 125.89,25.08 | J62.2 127.63,120.74
  Bottom 0.813: 125.89,25.08 121.28,29.84
  Bottom 1.016: JA66.2 JA65.2 119.67,76.71
G6
  Bottom 0.61: JA74B.2 159.1,111.63 160.81,113.35 160.81,125.09 157.64,127.95 143.35,127.95 138.91,127.32 J84.2 136.59,127 J59.2
G6B
  Bottom 1.016: J85.2 J84.1
G6C
  Bottom 0.61: J85.1 137.79,117.41 137.79,106.68 138.59,105.73 138.59,102.87 140.18,101.28 144.3,101.28 146.53,96.52 148.4,92.74 JA59.2 151.92,90.65 154.31,88.27 154.31,81.28 155.42,79.85 155.42,68.58 152.59,65.91 JA67B.2 | 143.35,16.83 143.35,19.84 139.7,22.54 139.7,27.62 141.6,29.53 | 151.32,65.91 JA67B.2 | 141.6,29.53 141.6,39.69 143.19,41.59 143.19,47.02 JB74.1 146.21,47.18 149.22,50.2 149.22,63.69 JA67B.2 | JA67.2 153.16,26.67 149.22,26.67 146.37,29.53 141.6,29.53
  Bottom 0.813: 139.7,27.62 JA81.2
  Bottom 1.016: JA85.2 143.51,13.34 | 143.51,13.34 146.08,13.34 JA86.2 | 143.35,16.83 143.35,13.49 143.51,13.34
G11
  Bottom 0.61: J69.2 57.63,120.33 58.26,116.84 61.12,115.25 61.12,111.76 2D2.8
G12
  Bottom 0.61: J68.2 52.23,117.47 52.23,118.43 J69.1
G13
  Bottom 1.016: J67.2 J68.1
G14
  Bottom 0.406: J67.1 42.07,115.57 39.21,113.66 35.88,113.66 33.66,111.44 32.86,111.44 30.32,110.49 27.46,110.49 26.35,109.7 17.15,109.7 13.49,106.05 SV4.2
GG5
  Bottom 0.61: 2D2.11 50.64,110.49 50.64,113.35 50.01,113.98 50.01,117.16 2R5.2 J61.1
GND2  (via drill 0.8 pad 2.3)
  Top 0.61: v129.06,104.78 103.98,104.78 103.98,107 97.95,107 97.95,104.78 85.25,104.78 85.25,106.05 78.26,106.05 78.26,104.78 66.2,104.78 66.2,106.05 59.85,106.05 59.85,105.41 58.58,105.41 | 58.58,105.41 43.97,105.41 2C1.2 40.8,100.33 10.95,100.33 SV4.1 | 58.58,105.41 v58.58,103.83
  Bottom 1.016: 2D1.4 2D1.5 2C2.2
  Bottom 1.27: 131.29,104.78 131.29,109.86 132.87,111.44 2D1.5 | 131.29,104.78 132.24,103.82 2D1.8 | 2D2.7 v58.58,103.83 | v129.06,104.78 131.29,104.78
N$2  (via drill 3 pad 5)
  other vias: 137.48,131.44
N$3  (via drill 3 pad 5)
  other vias: 146.21,3.18
N$4  (via drill 1 pad 2)
  other vias: 143.99,25.4
N$11  (via drill 1.5 pad 5)
  other vias: 3.02,3.18
N$65  (via drill 1 pad 2)
  other vias: 119.86,25.4
N$107
  Bottom 1.27: JB52.2 124.3,116.21 S52.SW1
N$117
  Bottom 0.61: 2D1.7 135.73,106.36 136.37,105.73 136.37,102.23 135.41,101.28 133.98,101.28 127.55,92.94 J83.2
N$151
  Bottom 1.016: S63.SW1 JB63.2
N$223  (via drill 3 pad 5)
  other vias: 166.37,63.5
N$224  (via drill 3 pad 5)
  other vias: 166.37,44.45
N$225
  Bottom 1.016: R16.1 2C2.1 J86.1
N$229
  Bottom 1.27: S74A.SW1 JB74.2
N$230
  Bottom 1.016: S74A.SW2 JA74.1
N$233
  Bottom 1.016: JB47.2 S47.SW1
N$234
  Bottom 1.016: JB53.2 S53.SW1
N$235
  Bottom 1.016: S60.SW1 JB60.2
N$236
  Bottom 1.016: JB68.2 S68.SW1
N$237
  Bottom 1.016: JB75.2 S75.SW1
N$238
  Bottom 1.016: S82.SW1 S82A.SW2 JB82.2
N$239
  Bottom 1.016: S48.SW1 40.16,116.21 42.07,118.11 JB48.2
N$240
  Bottom 1.016: JB54.2 S54.SW1
N$241
  Bottom 1.016: JB61.2 S61.SW1
N$242
  Bottom 1.016: S69.SW1 40.8,52.07 JB69.2
N$243
  Bottom 1.016: S49.SW1 JB49.2
N$244
  Bottom 1.016: S55.SW1 60.04,90.17 JB55.2
N$245
  Bottom 1.016: JB70.2 S70.SW1
N$246
  Bottom 1.016: JB77.2 S77.SW1
N$247
  Bottom 1.016: S56.SW1 JB56.2
N$248
  Bottom 1.016: JB51.2 S51.SW1
N$249
  Bottom 0.61: JB47.1 13.94,109.86 11.27,109.86 8.73,107 8.73,102.23 10,100.97 19.21,100.97 22.7,97.79 22.7,87.31 20,84.93 20,82.71 22.38,80.17 D49.A
N$250
  Bottom 0.61: JB53.1 17.78,83.03 21.11,79.69 21.11,75.88 23.34,73.66 23.34,70.37 27.62,65.88 D55.A
N$251
  Bottom 0.61: JB60.1 18.89,63.18 23.97,57.15 23.97,50.48 30.32,44.13 34.02,44.13 D62.A
N$252
  Bottom 0.61: JB68.1 18.89,44.45 23.34,40.01 23.34,36.83 D70.A
N$253
  Bottom 1.016: D77.A 17.61,26.56 JB75.1
N$254
  Bottom 0.813: JB82.1 D84.A
N$255
  Bottom 1.27: D50.A JB48.1
N$256
  Bottom 0.61: JB54.1 D56.A
N$257
  Bottom 0.61: JB61.1 D63.A
N$258
  Bottom 0.61: JB69.1 D71.A
N$259
  Bottom 0.61: JB76.1 26.99,32.86 24.13,32.86 D78.A
N$260
  Bottom 1.016: D85.A JB83.1
N$261
  Bottom 0.813: JB49.1 68.23,119.14 D51.A
N$262
  Bottom 1.016: JB55.1 D57.A
N$263
  Bottom 0.61: JB62.1 D64.A
N$264
  Bottom 0.61: JB70.1 D72.A
N$265
  Bottom 0.61: JB77.1 54.01,29.08 52.86,27.3 52.86,25.51 D79.A
N$266
  Bottom 0.61: JB84.1 D86.A
N$267
  Bottom 0.813: D52.A 72.55,118.62 JB50.1
N$268
  Bottom 1.016: JB56.1 80.93,91.63 D58.A
N$269
  Bottom 1.016: JB63.1 D65.A
N$270
  Bottom 1.016: JB71.1 D73.A
N$271
  Bottom 1.016: JB78.1 D80.A
N$272
  Bottom 1.016: D87.A JB85.1
N$274
  Bottom 1.016: JB51.1 D53.A
N$275
  Bottom 1.016: JB57.1 84.96,86.85 D59.A
N$276  (via drill 3 pad 5)
  other vias: 166.37,105.41
N$277
  Bottom 1.016: JB64.1 84.17,67.44 87.47,64.14 D66.A
N$278
  Bottom 1.016: JB72.1 D74.A
N$279
  Bottom 1.016: JB79.1 D81.A
N$280
  Bottom 1.016: JB86.1 156.13,9.4 D88.A
N$281
  Bottom 0.813: D54.A 125.25,120.52 JB52.1
N$282
  Bottom 1.016: D60.A 102.71,90.04 JB58.1
N$283
  Bottom 0.813: D67.A 106.63,64.45 103.22,67.87
  Bottom 1.016: JB65.1 103.22,67.87
N$284  (via drill 3 pad 5)
  other vias: 166.37,131.44
N$285
  Bottom 0.61: JB73.1 D75.A
N$286
  Bottom 1.27: JB80.1 D82.A
N$287
  Bottom 0.61: D61.A 120.76,91.96 121.6,91.44 127.35,91.44 JB59.1
N$288
  Bottom 0.61: JB66.1 134.57,66.99 D68.A
N$289
  Bottom 1.016: JB67.1 D69.A
N$290
  Bottom 1.016: D83.A JB81.1
N$291
  Bottom 1.016: JA47.1 S47.SW2
N$292
  Bottom 1.016: JA53.1 S53.SW2
N$293
  Bottom 1.016: JA60.1 S60.SW2
N$294
  Bottom 1.016: JA68.1 S68.SW2
N$295
  Bottom 1.016: JA75.1 S75.SW2
N$296
  Bottom 0.61: 27.15,7.3 35.08,7.3 36.99,6.03 39.85,6.03 41.12,7.3 41.12,13.34 40.2,14.25 38.43,14.25 | 38.58,14.29 38.43,14.25 | 38.43,14.25 S82A.SW1
  Bottom 1.016: JA82.1 S82.SW2 27.15,7.3
N$297
  Bottom 1.016: S48.SW2 JA48.1
N$298
  Bottom 1.016: JA54.1 S54.SW2
N$299
  Bottom 1.016: JA61.1 30,69.85 S61.SW2
N$300
  Bottom 1.016: JA69.1 S69.SW2
N$301
  Bottom 1.016: S49.SW2 JA49.1
N$302
  Bottom 1.016: S55.SW2 JA55.1
N$303
  Bottom 1.016: JA70.1 S70.SW2
N$304
  Bottom 1.016: JA77.1 S77.SW2
N$305
  Bottom 1.016: JA56.1 S56.SW2
N$306
  Bottom 1.016: JA63.1 S63.SW2
N$307
  Bottom 1.016: JA51.1 S51.SW2
N$308
  Bottom 1.016: S52.SW2 JA52.1
N$309
  Bottom 0.61: JB74B.1 146.08,119.25 147.27,121.08 D64B.A
N$310
  Bottom 0.61: 2D1.11 143.67,108.58 147.16,106.05 154.15,106.05 158.43,101.76 158.43,67.31 159.54,59.37 159.54,40.16 161.29,38.1 161.29,31.75 155.26,24.45 148.75,24.45 146.12,19.6 J93.2
N$311
  Bottom 1.016: JA67B.1 S67C.SW1
N$312
  Bottom 0.61: JA74.2 126.4,56.83 D76.A
N$313
  Bottom 1.016: S67.SW2 JB67.2
N$314
  Bottom 1.016: JA67.1 S67.SW1
N$315
  Bottom 1.016: JB81.2 S81.SW2
N$316
  Bottom 1.016: S81.SW1 JA81.1
N$317
  Bottom 1.016: JB59.2 S59.SW2
N$318
  Bottom 1.016: JA59.1 S59.SW1
N$319
  Bottom 1.016: JB85.2 S85.SW2
N$320
  Bottom 1.27: S85.SW1 JA85.1
N$321
  Bottom 1.016: S74.SW2 JB74B.2
N$322
  Bottom 1.016: JA74B.1 S74.SW1
N$323
  Bottom 0.61: 2D1.9 145.73,102.55 148.43,96.84 150.5,92.87 J90.2
N$326
  Bottom 1.016: JB87.1 D89.A
N$327
  Bottom 1.422: JB50.2 S50.SW2
N$328
  Bottom 1.016: S50.SW1 JA50.1
N$329
  Bottom 1.016: JB78.2 S78.SW2
N$330
  Bottom 1.016: S78.SW1 JA78.1
N$331
  Bottom 0.61: D67B.A 140.61,69.45 JB67B.1
N$332
  Bottom 1.016: JB58.2 S58.SW2
N$333
  Bottom 1.016: JB65.2 S65.SW2
N$334
  Bottom 1.016: S65.SW1 JA65.1
N$335
  Bottom 1.016: S58.SW1 JA58.1
N$336
  Bottom 0.61: JB66.2 131.48,68.77 S66.SW1
N$337
  Bottom 1.016: JA66.1 S66.SW2
N$338
  Bottom 1.016: S79.SW2 JB79.2
N$339
  Bottom 1.016: S79.SW1 JA79.1
N$342
  Bottom 1.016: JB73.2 S73.SW2
N$343
  Bottom 1.016: JA73.1 S73.SW1
N$344
  Bottom 1.016: S80.SW1 JA80.1
N$345
  Bottom 1.016: JB80.2 S80.SW2
N$346
  Bottom 1.016: JB84.2 S84.SW2
N$347
  Bottom 1.27: S84.SW1 JA84.1
N$349
  Bottom 1.016: JB57.2 S57.SW2
N$350
  Bottom 1.016: S57.SW1 JA57.1
N$351
  Bottom 1.016: S64.SW1 JA64.1
N$352
  Bottom 1.016: JB64.2 S64.SW2
N$353
  Bottom 1.016: JB72.2 87.34,50.45 S72.SW2
N$354
  Bottom 1.016: S72.SW1 JA72.1
N$355
  Bottom 0.61: J49.2 105.89,83.19 102.71,86.68 99.22,86.68 97.63,85.09 J48.1
N$356
  Bottom 1.016: JB62.2 S62.SW2
N$357
  Bottom 1.016: S62.SW1 JA62.1
N$358
  Bottom 1.016: S71.SW1 JB71.2
N$359
  Bottom 1.016: JA71.1 S71.SW2
N$360
  Bottom 1.016: 2D1.6 R16.2
N$361
  Bottom 1.016: S76.SW2 JB76.2
N$362
  Bottom 1.016: S76.SW1 JA76.1
N$363
  Bottom 0.406: SV4.7 26.19,102.87 27.15,101.92 39.85,101.92 41.43,104.46 50.32,104.46 51.28,103.66 55.24,103.66 2D2.6
N$364
  Bottom 0.406: SV4.6 23.65,102.55 25.24,100.97 40.48,100.97 42.07,103.5 49.69,103.5 2D2.4
N$365
  Bottom 0.406: SV4.5 21.11,102.23 23.34,100.01 39.53,100.01 40.16,97.47 42.39,97.47 44.61,99.69
  Bottom 0.61: 44.61,99.69 2D2.2
N$366
  Bottom 0.61: J64.2 47.78,110.4 2D2.12
N$368
  Bottom 0.61: J57.1 61.52,78.33 58.9,82.87 57.31,82.87 J58.2
N$369
  Bottom 0.406: 83.34,130.18 87.47,127 91.28,127 95.41,130.18 | 76.36,130.18 71.91,127 68.1,127 64.93,129.22 | 102.71,130.18 106.2,127 110.33,127 114.14,130.18
  Bottom 0.61: J60.2 45.88,125.41 46.83,126.05 51.91,126.05 55.4,129.22 64.93,129.22 | 83.34,130.18 76.36,130.18 | 95.41,130.18 102.71,130.18 | 114.14,130.18 114.46,130.49 126.29,130.49 J59.1
N$370
  Bottom 1.016: 2D2.1 J63.1
N$371
  Bottom 0.406: SV4.4 18.57,106.36 19.84,107.47 27.94,107.47 29.37,108.58 31.59,108.58 33.81,109.54 34.93,109.54 37.31,111.76 39.21,111.76 41.75,112.08 J64.1
N$372
  Bottom 0.406: SV4.3 16.03,106.36 18.26,108.58 27.15,108.58 28.42,109.54 30.96,109.54 33.18,110.49 34.29,110.49 36.67,112.71 39.3,112.71 J65.1
N$373
  Bottom 1.016: J65.2 48.19,113.35 J66.1
N$374
  Bottom 0.61: 2D2.10 J66.2
N$378
  Bottom 1.016: D92.A D93.C
N$379
  Bottom 0.406: J70.1 79.03,104.91 80.17,106.05 | 83.34,106.05 86.52,103.82 87.15,103.5 93.91,103.5 J73.2
  Bottom 0.61: 80.17,106.05 83.34,106.05
N$380
  Bottom 0.406: 83.69,107.45 87.63,104.46 91.28,104.46 93.03,105.57 J74.2 | 79.76,107.45 J71.1
  Bottom 0.61: 79.76,107.45 83.69,107.45
N$381
  Bottom 0.406: 84.01,108.72 88.11,105.41 90.65,105.41 93.34,107.63 J75.2
  Bottom 0.61: J72.1 79.22,108.74 84.01,108.72
N$382
  Bottom 0.61: J73.1 98.81,104.78 102.71,104.78 105.57,102.23 111.69,102.23 J77.2
N$383
  Bottom 0.61: J74.1 103.66,106.05 106.52,103.5 110.01,103.5 112.55,106.05 J78.2
N$384
  Bottom 0.61: J75.1 98.58,108.27 99.54,107.63 104.3,107.63 107.16,105.09 109.38,105.09 112.55,108.27 J79.2
N$385
  Bottom 1.016: J79.1 J80.2
N$386
  Bottom 1.016: J77.1 J81.2
N$387
  Bottom 1.016: J78.1 J82.2
N$388
  Bottom 0.406: 129.54,119.54 129.54,114.78
  Bottom 0.61: J80.1 123.03,108.58 129.54,114.78 | 2D1.1 131.76,121.6 129.54,119.54
N$389
  Bottom 0.406: 130.49,117.16 130.49,113.82
  Bottom 0.61: J82.1 122.71,106.36 130.49,113.82 | 2D1.2 132.4,119.06 130.49,117.16
N$391
  Bottom 0.406: 131.6,115.09 131.6,113.03
  Bottom 0.61: J81.1 122.4,104.14 131.6,113.03 | 2D1.3 133.03,116.52 131.6,115.09
N$392  (via drill 3 pad 5)
  other vias: 166.37,25.4
N$396
  Bottom 1.016: S86.SW1 JB86.2
N$397
  Bottom 1.016: S86.SW2 JA86.1
N$399
  Bottom 0.61: J91.2 123.26,67.4 125.25,64.45 125.25,60.48 127.63,58.1 131.29,58.1 133.83,60.64 133.83,64.45 138.91,68.1 138.91,76.83 J90.1
N$405
  Bottom 0.406: 128.59,120.33 128.59,115.73
  Bottom 0.61: J46.1 123.35,110.81 128.59,115.73 | J95.2 128.59,120.33
N$406
  Bottom 1.016: S67C.SW2 JB67B.2
N$407  (via drill 3 pad 5)
  other vias: 8.73,3.18
N$408  (via drill 3 pad 5)
  other vias: 24.61,3.18
N$409  (via drill 3 pad 5)
  other vias: 34.13,3.18
N$410  (via drill 3 pad 5)
  other vias: 58.9,3.18
N$411  (via drill 3 pad 5)
  other vias: 77.95,3.18
N$412  (via drill 3 pad 5)
  other vias: 102.08,3.18
N$413  (via drill 3 pad 5)
  other vias: 126.21,3.18
N$415  (via drill 3 pad 5)
  other vias: 166.37,3.18
N$417  (via drill 3 pad 5)
  other vias: 8.73,131.44
N$418  (via drill 3 pad 5)
  other vias: 24.61,131.44
N$419  (via drill 3 pad 5)
  other vias: 108.43,131.44
N$421  (via drill 3 pad 5)
  other vias: 47.47,131.44
N$422  (via drill 3 pad 5)
  other vias: 89.38,131.44
N$423  (via drill 3 pad 5)
  other vias: 70.33,131.44
N$424  (via drill 3 pad 5)
  other vias: 166.37,82.55
N$428  (via drill 1 pad 2)
  other vias: 122.08,99.69
N$429  (via drill 1 pad 2)
  other vias: 24.61,113.66
N$430  (via drill 1 pad 2)
  other vias: 24.61,82.55
N$431  (via drill 1 pad 2)
  other vias: 24.61,63.5
N$432  (via drill 1 pad 2)
  other vias: 24.61,44.45
N$433  (via drill 1 pad 2)
  other vias: 43.66,63.5
N$434  (via drill 1 pad 2)
  other vias: 43.66,82.55
N$435  (via drill 1 pad 2)
  other vias: 63.66,82.87
N$436  (via drill 1 pad 2)
  other vias: 63.66,63.5
N$437  (via drill 1 pad 2)
  other vias: 43.66,44.45
N$438  (via drill 1 pad 2)
  other vias: 24.61,25.4
N$439  (via drill 1 pad 2)
  other vias: 43.66,24.77
N$440  (via drill 1 pad 2)
  other vias: 62.07,26.03
N$441  (via drill 1 pad 2)
  other vias: 81.12,25.72
N$442  (via drill 1 pad 2)
  other vias: 62.71,44.45
N$480  (via drill 1 pad 2)
  other vias: 81.6,45.72
N$481  (via drill 1 pad 2)
  other vias: 101.76,25.4
N$482  (via drill 1 pad 2)
  other vias: 100.81,44.45
N$489  (via drill 1 pad 2)
  other vias: 138.91,63.5
N$490  (via drill 1 pad 2)
  other vias: 119.86,44.45
N$491  (via drill 1 pad 2)
  other vias: 120.81,63.5
N$492  (via drill 1 pad 2)
  other vias: 100.81,63.5
N$493  (via drill 1 pad 2)
  other vias: 81.76,63.5
N$494  (via drill 1 pad 2)
  other vias: 81.76,82.55
N$495  (via drill 1 pad 2)
  other vias: 119.86,82.55
N$497  (via drill 1 pad 2)
  other vias: 138.43,82.39
N$499  (via drill 1 pad 2)
  other vias: 100.81,82.55
N$500  (via drill 1 pad 2)
  other vias: 108.27,109.54
N$501  (via drill 1 pad 2)
  other vias: 101.12,101.12
N$502  (via drill 1 pad 2)
  other vias: 89.38,109.38
N$503  (via drill 1 pad 2)
  other vias: 81.76,102.08
N$504  (via drill 1 pad 2)
  other vias: 63.34,101.44
N$505  (via drill 1 pad 2)
  other vias: 70.17,109.54
PG3
  Bottom 0.406: 2D2.3 45.56,98.11 45.24,97.47 45.24,95.57 2R3.2
  Bottom 0.61: 2R3.2 45.56,93.03 46.2,89.22 47.47,86.36 49.37,84.14 J58.1
PG4
  Bottom 0.406: J76.1 72.87,100.33 67.47,100.33 65.56,97.47 60.48,97.47 58.26,100.01 54.45,100.01 2D2.5 52.55,100.01 48.42,100.01 47.47,99.06 2R4.2
PG5
  Bottom 0.406: 83.34,128.59 87.15,126.05 91.6,126.05 95.41,128.59 | 76.04,128.59 72.23,126.05 67.47,126.05 64.61,127.63 | 102.71,128.59 105.89,126.05 110.65,126.05 114.14,128.91
  Bottom 0.61: 102.71,128.59 95.41,128.59 | J61.2 52.14,124.05 56.36,127.63 64.61,127.63 | 83.34,128.59 76.04,128.59 | 114.14,128.91 124.85,128.91 126.12,126.37 J62.1
PG6
  Bottom 0.61: 2D2.13 44.93,110.81 44.93,117.47 | 44.93,117.47 43.97,118.11 43.97,120.97 J60.1 | 44.93,117.47 2R6.2

## Text on the board
Bottom: 1177-16